# Altium schematic sheet 3V_Regulation.SchDoc
size A1
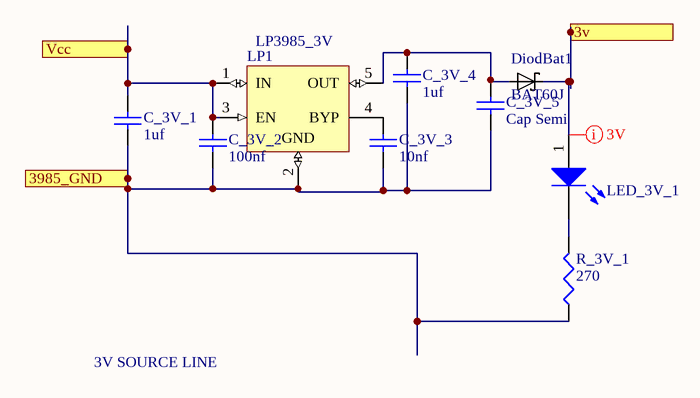
[diagram p0: 3V_Regulation.SchDoc]

## Parts
C_3V_1  1uf  [1608(0603)]
C_3V_2  100nf  [1608(0603)]
C_3V_3  10nf  [1608(0603)]
C_3V_4  1uf  [1608(0603)]
C_3V_5  Cap Semi  [1608(0603)]
DiodBat1  BAT60J  [*SOD323_ST_BAT60J(Primary)]
LED_3V_1  L_green  [LED_0603]  (value not drawn)
LP1  LP3985_3V  [*SOT95P280X145-5N]
R_3V_1  value 270  [1608(0603)]  (hidden comment: Res3)

## Ports
3v (out), 3985_GND (in), Vcc (in)

## Nets
3v: DiodBat1.C LED_3V_1.1(V) ; port 3v
3985_GND: C_3V_1.1 C_3V_2.1 C_3V_3.1 C_3V_4.1 C_3V_5.1 LP1.2(GND) R_3V_1.1 ; port 3985_GND
Vcc: C_3V_1.2 C_3V_2.2 LP1.1(IN) LP1.3(EN) ; port Vcc
NetC_3V_3_2: C_3V_3.2 LP1.4(BYP)
NetC_3V_4_2: C_3V_4.2 C_3V_5.2 DiodBat1.A LP1.5(OUT)
NetLED_3V_1_2: LED_3V_1.2(K) R_3V_1.2

## Layout directives
net class GND; rule Routing Layers [TopLayer - Enabled BottomLayer - Enabled ]; rule Width Constraint [Pref Width = 10mil    Min Width = 10mil    Max Width = 10mil]: 3v

## Notes on the sheet
- 3V SOURCE LINE

## Library data of the parts
C_3V_1-C_3V_5 = Cap Semi: Capacitor (Semiconductor SIM Model); Value: 100pF; Published: 8-Jun-2000; LatestRevisionDate: 29-May-2009; LatestRevisionNote: IPC-7351 Footprint Added.; PackageReference: C1206; Publisher: Altium Limited; PackageDescription: Chip Capacitor
DiodBat1 = BAT60J: MF: STMicroelectronics; Package: None; MP: BAT60J; SnapEDA_Link: https://www.snapeda.com/parts/BAT60J/STMicroelectronics/view-part/?ref=snap; Availability: Unavailable; Price: None; Value: *
LP1 = LP3985IM5-2.9: Micropower, 150mA Low-Noise Ultra Low-Dropout CMOS Voltage Regulator, 5-pin SOT-23; Manufacturer: National Semiconductor; PackageTopMarking: LCYB*XTT; PowerWise: N; CompType: LDO IC; PinCount: 5; DatasheetVersion: Aug-2005; PackageVersion: revD, Aug-2008; PackageReference: MF05A; PackageDescription: Molded SOT-23, .115 x .063 x .040 in Body, 5 Lead, .0375 in Pitch; RoHS: Y; PartNumber: LP3985IM5-2.9
R_3V_1 = Res3: Resistor; Published: 8-Jun-2000; LatestRevisionDate: 29-May-2009; LatestRevisionNote: IPC-7351 Footprint Added.; PackageReference: J1-0603; Publisher: Altium Limited; PackageDescription: Chip Resistor